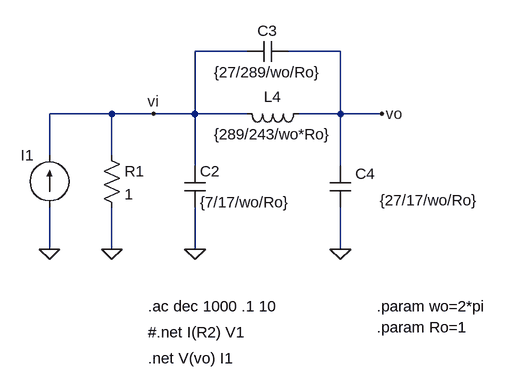
[diagram p0: schematic pi_simple_cargado.asc]
pi_simple_cargado.asc, the LTspice schematic file:
Version 4
SHEET 1 988 1328
WIRE 160 368 80 368
WIRE 304 368 224 368
WIRE -48 464 -144 464
WIRE 16 464 -48 464
WIRE 80 464 80 368
WIRE 80 464 16 464
WIRE 160 464 80 464
WIRE 304 464 304 368
WIRE 304 464 240 464
WIRE 368 464 304 464
WIRE -144 528 -144 464
WIRE -48 528 -48 464
WIRE 80 544 80 464
WIRE 304 544 304 464
WIRE -144 672 -144 608
WIRE -48 672 -48 608
WIRE 80 672 80 608
WIRE 304 672 304 608
FLAG -144 672 0
FLAG 368 464 vo
FLAG -48 672 0
FLAG 80 672 0
FLAG 304 672 0
FLAG 16 464 vi
SYMBOL current -144 608 R180
WINDOW 0 24 80 Left 2
WINDOW 3 24 0 Invisible 2
WINDOW 39 0 0 Left 0
SYMATTR InstName I1
SYMATTR Value 0
SYMATTR Value2 AC 1 0
SYMBOL res -64 512 R0
SYMATTR InstName R1
SYMATTR Value 1
SYMBOL cap 64 544 R0
SYMATTR InstName C2
SYMATTR Value {7/17/wo/Ro}
SYMBOL cap 224 352 R90
WINDOW 0 0 32 VBottom 2
WINDOW 3 32 32 VTop 2
SYMATTR InstName C3
SYMATTR Value {27/289/wo/Ro}
SYMBOL cap 320 608 R180
WINDOW 0 -38 52 Left 2
WINDOW 3 -197 11 Left 2
SYMATTR InstName C4
SYMATTR Value {27/17/wo/Ro}
SYMBOL ind 256 448 R90
WINDOW 0 5 56 VBottom 2
WINDOW 3 32 56 VTop 2
SYMATTR InstName L4
SYMATTR Value {289/243/wo*Ro}
SYMATTR SpiceLine Rser=0
TEXT 8 800 Left 2 !#.net I(R2) V1
TEXT 8 760 Left 2 !.ac dec 1000 .1 10
TEXT 360 760 Left 2 !.param wo=2*pi
TEXT 360 792 Left 2 !.param Ro=1
TEXT 8 840 Left 2 !.net V(vo) I1

The netlist it stands for:
* pi_simple_cargado.asc
I1 0 vi 0 AC 1 0
R1 vi 0 1
C2 vi 0 {7/17/wo/Ro}
C3 vo vi {27/289/wo/Ro}
C4 0 vo {27/17/wo/Ro}
L4 vo vi {289/243/wo*Ro} Rser=0
#.net I(R2) V1
.ac dec 1000 .1 10
.param wo=2*pi
.param Ro=1
.net V(vo) I1
.backanno
.end

* Results of the author's LTspice run, read from the files saved beside the schematic
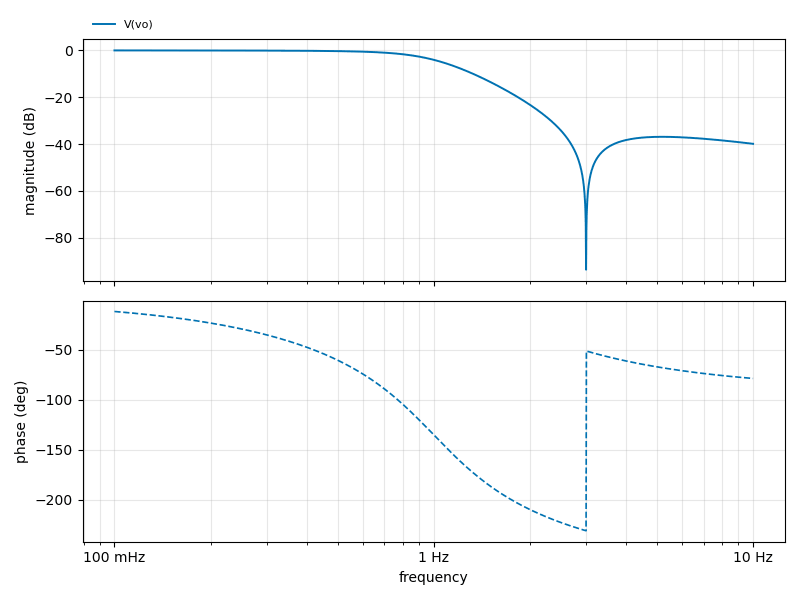
[diagram p1: AC Analysis of pi_simple_cargado.asc, plotted from the saved traces]
* AC Analysis, 1 run:
*   V(vo): -0.01 dB at 100 mHz, -39.90 dB at 10 Hz, peak -0.01 dB at 100 mHz, 3 dB below the peak at 928.1 mHz